# Altium project ISL.PrjPCB
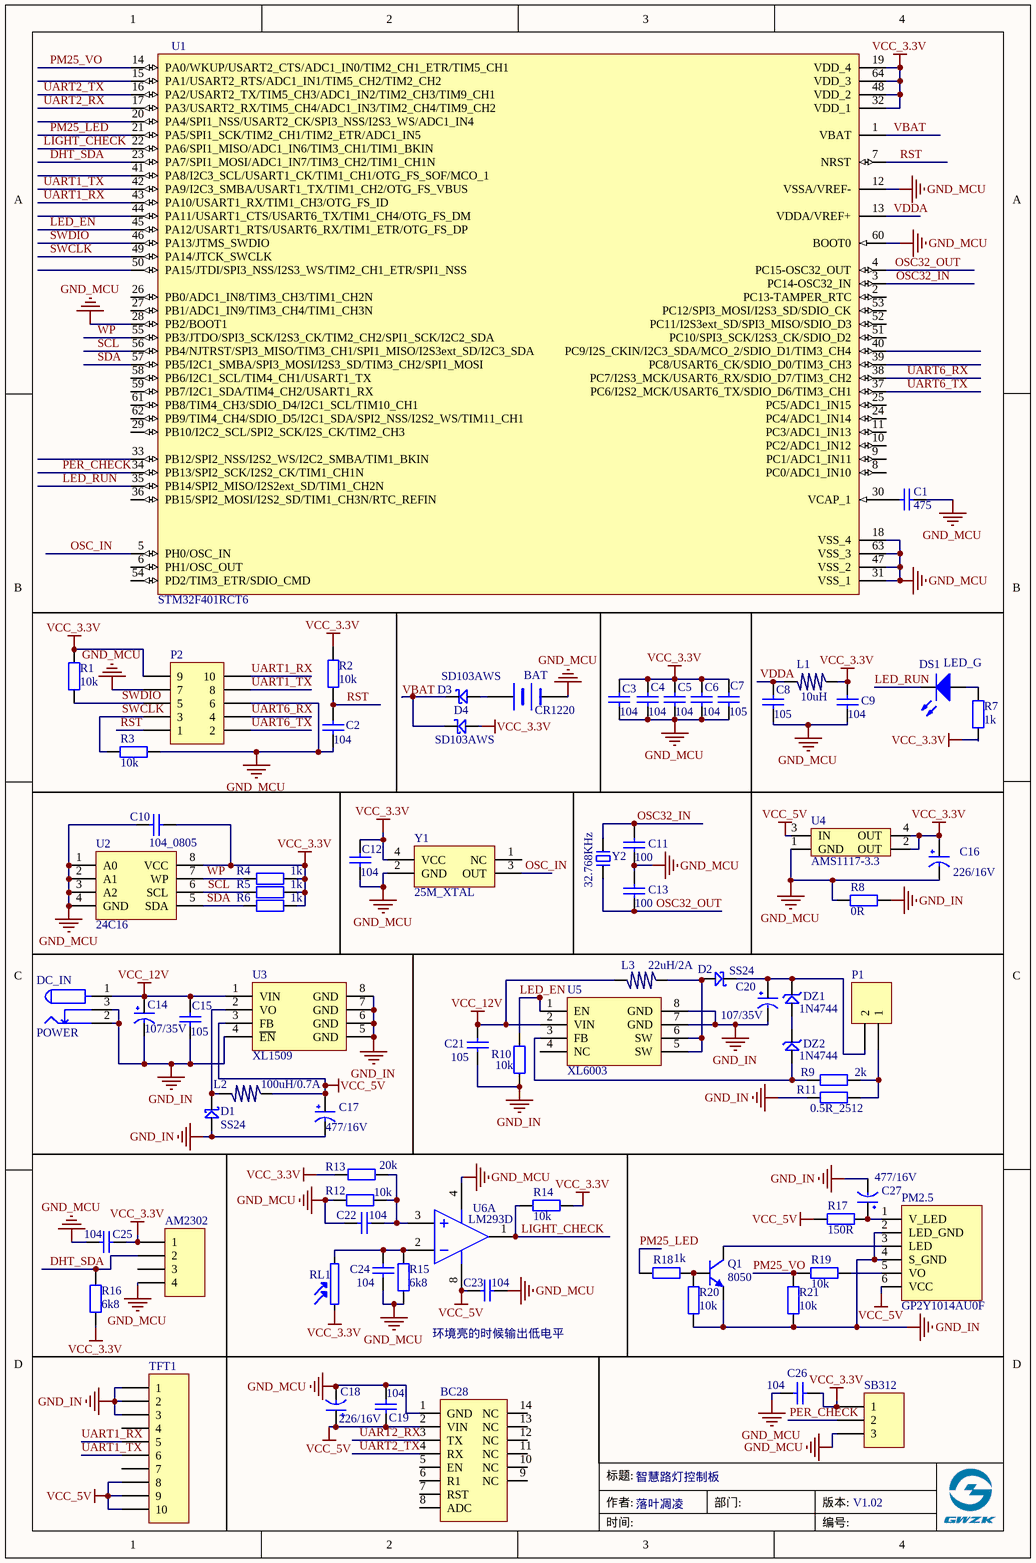
[diagram p0: ISL.SchDoc]
1 sheet, 77 parts. Net scope: global (net labels, ports and power ports of the same name join across sheets).
Board file: ISL.PcbDoc

## Sheet ISL.SchDoc
size A4 portrait; Organization: Altium Limited; Address1: L3, 12a Rodborough Rd; Address2: Frenchs Forest; Address3: NSW; Address4: Australia 2086

### Parts
AM2302  Header 4  [AM2302(DHT11)]  (value not drawn)
BAT  CR1220  [CR1220_B]
BC28  BC28  [BC28-安联德]  (value not drawn)
C1  475  [C 0805]
C2  104  [C 0805]
C3  104  [C 0805]
C4  104  [C 0805]
C5  104  [C 0805]
C6  104  [C 0805]
C7  105  [C 0805]
C8  105  [C 0805]
C9  104  [C 0805]
C10  104_0805  [C 0805]
C11  100  [C 0805]
C12  104  [C 0805]
C13  100  [C 0805]
C14  107/35V  [CAP 2.5*6.3*11.2]
C15  105  [C 0805]
C16  226/16V  [CD B(3528)]
C17  477/16V  [CAP 3.5*8*11.5]
C18  226/16V  [CD B(3528)]
C19  104  [C 0805]
C20  107/35V  [CAP 2.5*6.3*11.2]
C21  105  [C 0805]
C22  104  [C 0805]
C23  104  [C 0805]
C24  104  [C 0805]
C25  104  [C 0805]
C26  104  [C 0805]
C27  477/16V  [CAP 3.5*8*11.5]
D1  SS24  [SMA]
D2  SS24  [SMA]
D3  SD103AWS  [SOD-323]
D4  SD103AWS  [SOD-323]
DC_IN  POWER  [DC-005]
DS1  LED_G  [LED 0805]
DZ1  1N4744  [DO-41]
DZ2  1N4744  [DO-41]
L1  10uH  [L 0805]
L2  100uH/0.7A  [NR6045]
L3  22uH/2A  [NR6045]
P1  Header 2  [KF2EDGRM-X-2P]  (value not drawn)
P2  Header 5X2  [HDR2.54-WI-2x5P]  (value not drawn)
PM2.5  GP2Y1014AU0F  [PH2.0-WS-6P]
Q1  8050  [SOT23-3N]
R1  10k  [R 0805]
R2  10k  [R 0805]
R3  10k  [R 0805]
R4  1k  [R 0805]
R5  1k  [R 0805]
R6  1k  [R 0805]
R7  1k  [R 0805]
R8  0R  [R 0805]
R9  2k  [R 0805]
R10  10k  [R 0805]
R11  0.5R_2512  [R 2512]
R12  10k  [R 0805]
R13  20k  [R 0805]
R14  10k  [R 0805]
R15  6k8  [R 0805]
R16  6k8  [R 0805]
R17  150R  [R 0805]
R18  1k  [R 0805]
R19  10k  [R 0805]
R20  10k  [R 0805]
R21  10k  [R 0805]
RL1  RL  [光敏电阻]  (value not drawn)
SB312  Header 3  [HDR2.54-LI-3P]  (value not drawn)
TFT1  Header 10  [FPC1.0-2H-WS-10P]  (value not drawn)
U1  STM32F401RCT6  [LQFP64 10x10_L]
U2  24C16  [SOP8_L]
U3  XL1509  [SOP8_L]
U4  AMS1117-3.3  [SOT223_N]
U5  XL6003  [SOP8_L]
U6  LM293D  [SOP8_L]  (part A of 2)
Y1  25M_XTAL  [OSC 7050-4P]
Y2  32.768KHz  [OSC 3215-2P]

### Nets
GND_IN: C14.2(GND) C15.1 C17.2(GND) C20.2(GND) C21.1 C27.2(GND) D1.1(A) DC_IN.2 DC_IN.3 PM2.5.2(LED_GND) PM2.5.4(S_GND) Q1.2 R8.1 R10.1 R11.1 R20.2 R21.2 TFT1.1 TFT1.2 TFT1.3 U3.4(~{EN}) U3.5(GND) U3.6(GND) U3.7(GND) U3.8(GND) U5.7(GND) U5.8(GND)
GND_MCU: AM2302.4 BAT.2(-) BC28.1(GND) C1.1 C2.1 C3.1 C4.1 C5.1 C6.1 C7.1 C8.1 C9.1 C10.2 C11.1 C12.1 C13.2 C16.2(GND) C18.2(GND) C19.2 C22.2 C23.1 C24.1 C25.2 C26.2 P2.6 P2.7 R3.2 R8.2 R12.1 R15.1 SB312.3 U1.12(VSSA/VREF-) U1.18(VSS_4) U1.28(PB2/BOOT1) U1.31(VSS_1) U1.47(VSS_2) U1.60(BOOT0) U1.63(VSS_3) U2.1(A0) U2.2(A1) U2.3(A2) U2.4(GND) U4.1(GND) U6.4(V-) Y1.2(GND)
VCC_3.3V: AM2302.1 C3.2 C4.2 C5.2 C6.2 C7.2 C9.2 C10.1 C12.2 C16.1(VCC) C25.1 C26.1 D4.1(A) L1.1 P2.9 R1.1 R2.1 R4.2 R5.2 R6.2 R7.2 R13.2 R14.2 R16.1 RL1.2 SB312.1 U1.19(VDD_4) U1.32(VDD_1) U1.48(VDD_2) U1.64(VDD_3) U2.8(VCC) U4.2(OUT) U4.4(OUT) Y1.4(VCC)
VCC_5V: BC28.2(VIN) C17.1(VCC) C18.1(VCC) C19.1 C23.2 L2.1 PM2.5.6(VCC) R17.1 TFT1.8 TFT1.9 TFT1.10 U3.3(FB) U4.3(IN) U6.8(V+)
VCC_12V: C14.1(VCC) C15.2 C21.2 DC_IN.1 L3.2 U3.1(VIN) U5.2(VIN)
DHT_SDA: AM2302.2 R16.2 U1.23(PA7/SPI1_MOSI/ADC1_IN7/TIM3_CH2/TIM1_CH1N)
LED_EN: R10.2 U1.45(PA12/USART1_RTS/USART6_RX/TIM1_ETR/OTG_FS_DP) U5.1(EN)
LED_RUN: DS1.K U1.35(PB14/SPI2_MISO/I2S2ext_SD/TIM1_CH2N)
LIGHT_CHECK: R14.1 U1.22(PA6/SPI1_MISO/ADC1_IN6/TIM3_CH1/TIM1_BKIN) U6.1(OUT)
OSC32_IN: C11.2 U1.3(PC14-OSC32_IN) Y2.2
OSC32_OUT: C13.1 U1.4(PC15-OSC32_OUT) Y2.1
OSC_IN: U1.5(PH0/OSC_IN) Y1.3(OUT)
PER_CHECK: SB312.2 U1.34(PB13/SPI2_SCK/I2S2_CK/TIM1_CH1N)
PM25_LED: R18.2 U1.21(PA5/SPI1_SCK/TIM2_CH1/TIM2_ETR/ADC1_IN5)
PM25_VO: R19.1 R21.1 U1.14(PA0/WKUP/USART2_CTS/ADC1_IN0/TIM2_CH1_ETR/TIM5_CH1)
RST: C2.2 P2.1 R2.2 U1.7(NRST)
SCL: R5.1 U1.56(PB4/NJTRST/SPI3_MISO/TIM3_CH1/SPI1_MISO/I2S3ext_SD/I2C3_SDA) U2.6(SCL)
SDA: R6.1 U1.57(PB5/I2C1_SMBA/SPI3_MOSI/I2S3_SD/TIM3_CH2/SPI1_MOSI) U2.5(SDA)
SWCLK: P2.3 R3.1 U1.49(PA14/JTCK_SWCLK)
SWDIO: P2.5 R1.2 U1.46(PA13/JTMS_SWDIO)
UART1_RX: P2.10 TFT1.5 U1.43(PA10/USART1_RX/TIM1_CH3/OTG_FS_ID)
UART1_TX: P2.8 TFT1.6 U1.42(PA9/I2C3_SMBA/USART1_TX/TIM1_CH2/OTG_FS_VBUS)
UART2_RX: BC28.3(TX) U1.17(PA3/USART2_RX/TIM5_CH4/ADC1_IN3/TIM2_CH4/TIM9_CH2)
UART2_TX: BC28.4(RX) U1.16(PA2/USART2_TX/TIM5_CH3/ADC1_IN2/TIM2_CH3/TIM9_CH1)
UART6_RX: P2.4 U1.38(PC7/I2S3_MCK/USART6_RX/SDIO_D7/TIM3_CH2)
UART6_TX: P2.2 U1.37(PC6/I2S2_MCK/USART6_TX/SDIO_D6/TIM3_CH1)
VBAT: D3.2(K) D4.2(K) U1.1(VBAT)
VDDA: C8.2 L1.2 U1.13(VDDA/VREF+)
WP: R4.1 U1.55(PB3/JTDO/SPI3_SCK/I2S3_CK/TIM2_CH2/SPI1_SCK/I2C2_SDA) U2.7(WP)
NetBAT_1: BAT.1(+) D3.1(A)
NetC1_2: C1.2 U1.30(VCAP_1)
NetC20_1: C20.1(VCC) D2.2(K) DZ1.2 P1.2
NetC22_1: C22.1 R12.2 R13.1 U6.3(IN+)
NetC24_2: C24.2 R15.2 RL1.1 U6.2(IN-)
NetC27_1: C27.1(VCC) PM2.5.1(V_LED) R17.2
NetD1_2: D1.2(K) L2.2 U3.2(VO)
NetD2_1: D2.1(A) L3.1 U5.5(SW) U5.6(SW)
NetDS1_A: DS1.A R7.1
NetDZ1_1: DZ1.1 DZ2.2
NetDZ2_1: DZ2.1 R9.1 U5.3(FB)
NetP1_1: P1.1 R9.2 R11.2
NetPM2.5_3: PM2.5.3(LED) Q1.3
NetPM2.5_5: PM2.5.5(VO) R19.2
NetQ1_1: Q1.1 R18.1 R20.1

Not connected (* = marked no-connect by the designer): AM2302 3; BC28 5(EN) 6(R1) 7(RST) 8(ADC) 9(NC) 10(NC) 11(NC) 12(NC) 13(NC) 14(NC); TFT1 4 7; U1 2(PC13-TAMPER_RTC) 6(PH1/OSC_OUT) 8(PC0/ADC1_IN10) 9(PC1/ADC1_IN11) 10(PC2/ADC1_IN12) 11(PC3/ADC1_IN13) 15(PA1/USART2_RTS/ADC1_IN1/TIM5_CH2/TIM2_CH2) 20(PA4/SPI1_NSS/USART2_CK/SPI3_NSS/I2S3_WS/ADC1_IN4) 24(PC4/ADC1_IN14) 25(PC5/ADC1_IN15) 26(PB0/ADC1_IN8/TIM3_CH3/TIM1_CH2N) 27(PB1/ADC1_IN9/TIM3_CH4/TIM1_CH3N) 29(PB10/I2C2_SCL/SPI2_SCK/I2S_CK/TIM2_CH3) 33(PB12/SPI2_NSS/I2S2_WS/I2C2_SMBA/TIM1_BKIN) 36(PB15/SPI2_MOSI/I2S2_SD/TIM1_CH3N/RTC_REFIN) 39(PC8/USART6_CK/SDIO_D0/TIM3_CH3) 40(PC9/I2S_CKIN/I2C3_SDA/MCO_2/SDIO_D1/TIM3_CH4) 41(PA8/I2C3_SCL/USART1_CK/TIM1_CH1/OTG_FS_SOF/MCO_1) 44(PA11/USART1_CTS/USART6_TX/TIM1_CH4/OTG_FS_DM) 50(PA15/JTDI/SPI3_NSS/I2S3_WS/TIM2_CH1_ETR/SPI1_NSS) 51(PC10/SPI3_SCK/I2S3_CK/SDIO_D2) 52(PC11/I2S3ext_SD/SPI3_MISO/SDIO_D3) 53(PC12/SPI3_MOSI/I2S3_SD/SDIO_CK) 54(PD2/TIM3_ETR/SDIO_CMD) 58(PB6/I2C1_SCL/TIM4_CH1/USART1_TX) 59(PB7/I2C1_SDA/TIM4_CH2/USART1_RX) 61(PB8/TIM4_CH3/SDIO_D4/I2C1_SCL/TIM10_CH1) 62(PB9/TIM4_CH4/SDIO_D5/I2C1_SDA/SPI2_NSS/I2S2_WS/TIM11_CH1); U5 4(NC); Y1 1(NC)

### Notes on the sheet
- 环境亮的时候输出低电平
- 落叶凋凌
- 智慧路灯控制板
- V1.02
- 标题:
- 作者:
- 部门:
- 版本:
- 时间:
- 编号:

### Library data of the parts
AM2302 = Header 4: Header, 4-Pin; LatestRevisionDate: 17-Jul-2002; LatestRevisionNote: Re-released for DXP Platform.; Publisher: Altium Limited
BAT = BATTERY
C1 C7 C8 C10 C11 C13 C15 C21 = Cap: Capacitor; Value: 104; Published: 8-Jun-2000; LatestRevisionDate: 17-Jul-2002; LatestRevisionNote: Re-released for DXP Platform.; PackageReference: RAD-0.3; Publisher: Altium Limited
C2-C6 C9 C12 C19 C22-C26 = Cap: Capacitor; Published: 8-Jun-2000; LatestRevisionDate: 17-Jul-2002; LatestRevisionNote: Re-released for DXP Platform.; PackageReference: RAD-0.3; Publisher: Altium Limited; Value: 104
C14 C16-C18 C20 C27 = CAP
D1-D4 = D_SCHOTTYK
DS1 = LED: Typical RED, GREEN, YELLOW, AMBER GaAs LED; Published: 8-Jun-2000; LatestRevisionDate: 17-Jul-2002; LatestRevisionNote: Re-released for DXP Platform.; PackageDocument: Feb-2002; PackageReference: 3.2X1.6X1.1; Publisher: Altium Limited
DZ1 DZ2 = D_ZENER
L1-L3 = L
P1 = Header 2: Header, 2-Pin; LatestRevisionDate: 17-Jul-2002; LatestRevisionNote: Re-released for DXP Platform.; Publisher: Altium Limited
P2 = Header 5X2: Header, 5-Pin, Dual row; LatestRevisionDate: 17-Jul-2002; LatestRevisionNote: Re-released for DXP Platform.; Publisher: Altium Limited
Q1 = 2N3904: NPN General Purpose Amplifier; Published: 8-Jun-2000; LatestRevisionDate: 15-Jan-2003; LatestRevisionNote: PCB Footprint 'BCY-W3/D4.7' replaced; DatasheetDocument: 1997; PackageDocument: Sep-1998; PackageReference: TO-92A; Publisher: Altium Limited; Code_JEDEC: TO-92A; ComponentLink1Description: Manufacturer Link; ComponentLink1URL: http://www.fairchildsemi.com/; ComponentLink2Description: Datasheet; ComponentLink2URL: http://www.fairchildsemi.com/ds/2N%2F2N3904.pdf
R1-R21 = Res2: Resistor; Value: 10K_0805; Published: 8-Jun-2000; LatestRevisionDate: 17-Jul-2002; LatestRevisionNote: Re-released for DXP Platform.; PackageReference: AXIAL-0.4; Publisher: Altium Limited
SB312 = Header 3: Header, 3-Pin; LatestRevisionDate: 17-Jul-2002; LatestRevisionNote: Re-released for DXP Platform.; Publisher: Altium Limited
TFT1 = Header 10: Header, 10-Pin; LatestRevisionDate: 17-Jul-2002; LatestRevisionNote: Re-released for DXP Platform.; Publisher: Altium Limited
U1 = STM32F401RxT6
U2 = 24Cxx: EEPROM
U3 = XL1059
U4 = AMS1117
U6 = OPA_8PIN
Y1 = 8M_XTAL
Y2 = XTAL-2: 2脚晶振; 版权归属: 源创客; BOM名称: 2脚晶振; 学习资源: www.ooocke.com